# EAGLE design carteAlim (EAGLE 6.4)
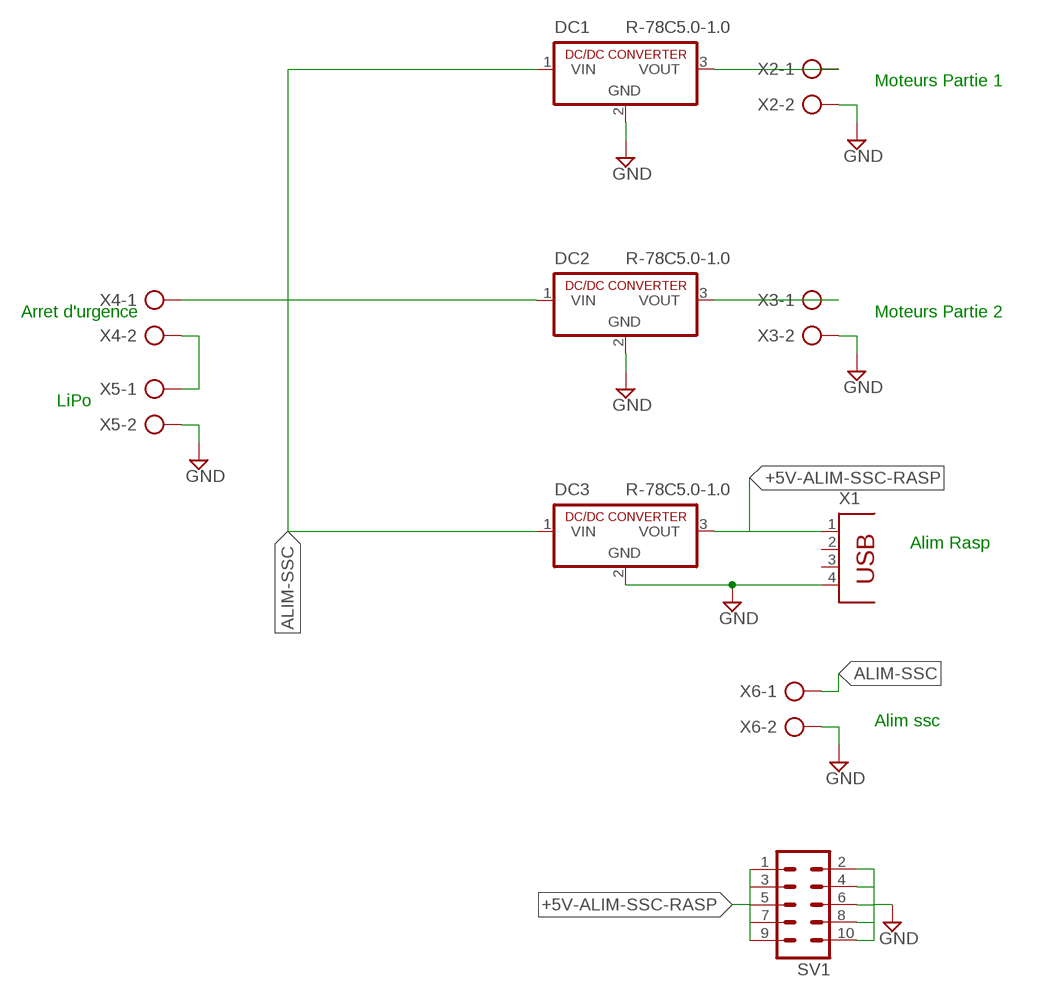
[diagram p0: schematic, sheet 1]

## Parts
DC1  R-78C5.0-1.0  [SIP3]
DC2  R-78C5.0-1.0  [SIP3]
DC3  R-78C5.0-1.0  [SIP3]
SV1  MA05-2  [MA05-2]
X1  PN87520  [PN87520]
X2  AK300/2  [AK300/2]
X3  AK300/2  [AK300/2]
X4  AK300/2  [AK300/2]
X5  AK300/2  [AK300/2]
X6  AK300/2  [AK300/2]

## Nets
+5V-ALIM-SSC-RASP: DC3.3(VOUT) SV1.1 SV1.9 X1.1
ALIM-SSC: DC1.1(VIN) DC2.1(VIN) DC3.1(VIN) X4.1 X6.1
GND: DC1.2(GND) DC2.2(GND) DC3.2(GND) SV1.2 SV1.4 SV1.6 SV1.8 SV1.10 X1.4 X2.2 X3.2 X5.2 X6.2
N$2: X4.2 X5.1
N$5: DC1.3(VOUT) X2.1
N$6: DC2.3(VOUT) X3.1
Unconnected: SV1.3 SV1.5 SV1.7 X1.2 X1.3

## Notes on the sheet
- Moteurs Partie 1
- Arret d'urgence | Moteurs Partie 2
- LiPo
- Alim Rasp
- Alim ssc

## Library data of the parts
DC1-DC3 = dc-dc-converter:R-78C*-1.0: INNOLINE DC/DC-Converter 1.0 AMP SIP3 Single Output Source: Data sheet <http://www.mikrocontroller.net/attachment/150645/157764-da-01-en-DC_DC_WANDLER_R_78C5_0_1_0.pdf>
SV1 = con-lstb:MA05-2: PIN HEADER; OC_FARNELL: unknown; OC_NEWARK: unknown
X1 = con-berg:PN87520: BERG USB connector; OC_FARNELL: unknown; OC_NEWARK: unknown
X2-X6 = con-ptr500:AK300/2: CONNECTOR; OC_FARNELL: unknown; OC_NEWARK: unknown

## Board
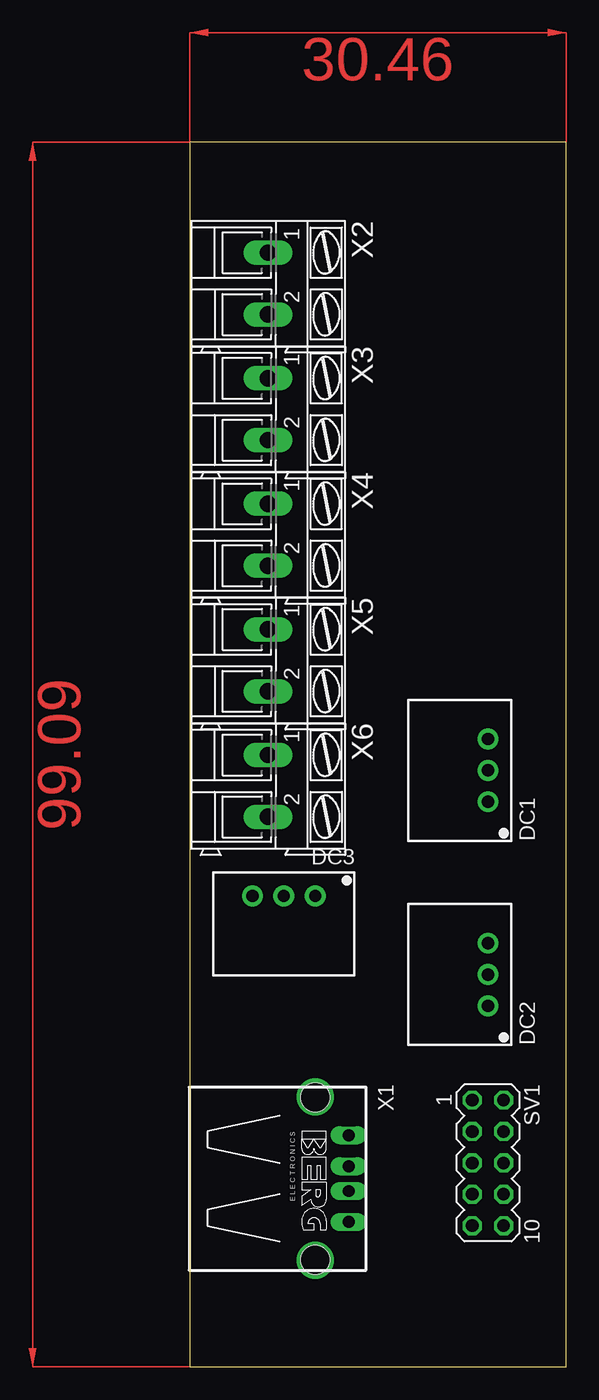
[diagram p1: board, top side]
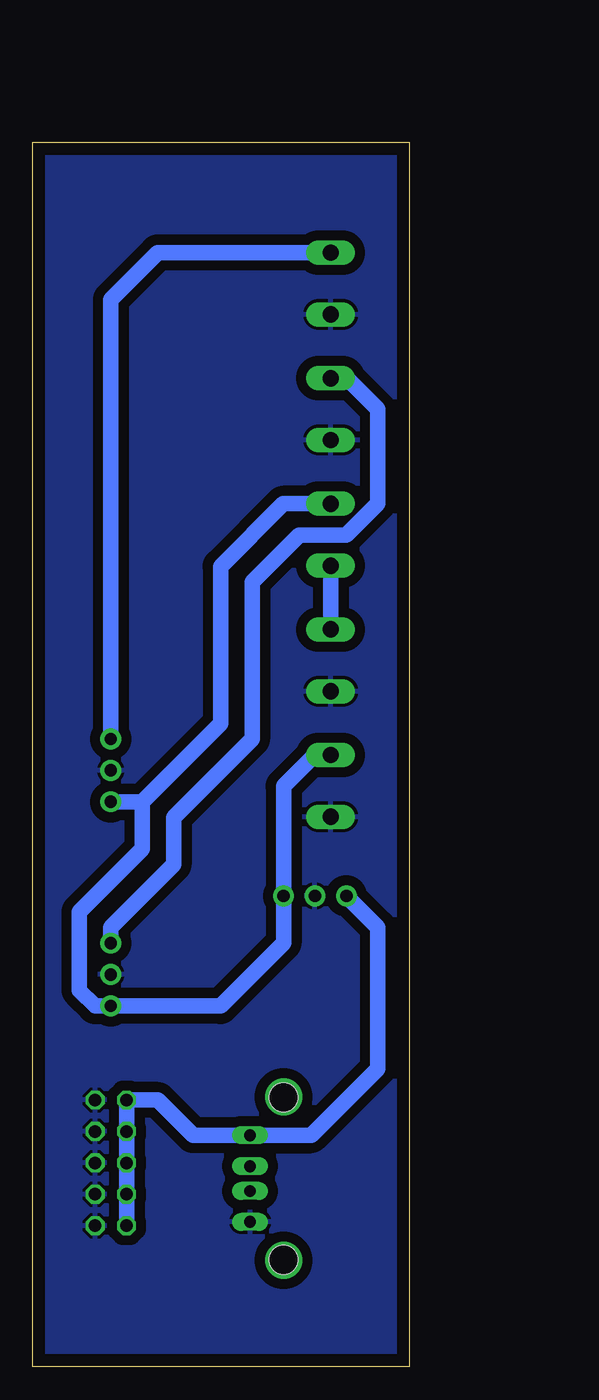
[diagram p2: board, bottom side, seen from below]

Size 30.46 x 99.09 mm. Coordinates in mm from the lower left corner, seen from the top.
Outline: 0,0 30.46,0 30.46,99.09 0,99.09 0,0
Copper layers (1*16): Top 0.035mm / dielectric 1.5mm / Bottom 0.035mm
Design rules "default *": minimum track width 10mil, minimum drill 24mil, track to track 12mil, track to pad 12mil, pad to pad 12mil, via to via 12mil, smd to smd 12mil, copper to edge 40mil, drill to drill 8mil, minimum pad ring 10mil, minimum via ring 8mil, stop-mask expansion 4mil, vias tented up to drill 0mil, thermal gap 10mil

### Footprints (pad centres in the part's own frame; a part is rotated, then mirrored left to right if it is on the bottom)
SIP3 = drill 1 pad 1.676: 1 -2.54,0; 2 0,0; 3 2.54,0
MA05-2 = drill 1.016 octagon: 1 -5.08,-1.27; 2 -5.08,1.27; 3 -2.54,-1.27; 4 -2.54,1.27; 5 0,-1.27; 6 0,1.27; 7 2.54,-1.27; 8 2.54,1.27; 9 5.08,-1.27; 10 5.08,1.27
PN87520 = drill 0.95 long: 1 -3.5,2.71; 2 -1,2.71; 3 1,2.71; 4 3.5,2.71 | hole 2.3: -6.57,0; 6.57,0
AK300/2 = drill 1.321 long: 1 -2.515,0; 2 2.489,0

### Placement (x,y rotation side)
DC1  24.13,48.26 90 top
DC2  24.13,31.75 90 top
DC3  7.62,38.1 180 top
SV1  24.13,16.51 270 top
X1  10.16,15.24 270 top
X2  6.35,87.63 270 top
X3  6.35,77.47 270 top
X4  6.35,67.31 270 top
X5  6.35,57.15 270 top
X6  6.35,46.99 270 top

### Tracks (layer width: path | path; a pad name or v marks a point on that pad's centre or on a via)
+5V-ALIM-SSC-RASP
  Bottom 1.27: SV1.9 SV1.1 20.32,21.59 17.47,18.74 X1.1 7.93,18.74 2.54,24.13 2.54,35.56 DC3.3
ALIM-SSC
  Bottom 1.27: X4.1 10.19,69.83 15.24,64.77 15.24,52.07 21.59,45.72 | 21.59,45.72 DC1.1 | 21.59,45.72 21.59,41.91 26.67,36.83 26.67,30.48 25.4,29.21 DC2.1 15.24,29.21 10.16,34.29 DC3.1 10.16,46.99 7.64,49.51 X6.1
GND
  pour Bottom (isolate 0.813): -1.27,99.06 31.75,99.06 31.75,-1.27 -1.27,-1.27
N$2
  Bottom 1.27: X4.2 X5.1
N$5
  Bottom 1.27: X2.1 20.34,90.14 24.13,86.36 DC1.3
N$6
  Bottom 1.27: X3.1 5.05,79.98 2.54,77.47 2.54,69.85 5.08,67.31 8.89,67.31 12.7,63.5 12.7,50.8 19.05,44.45 19.05,40.64 24.13,35.56 DC2.3
N$9  (via drill 2)
  other vias: 10.16,21.84
N$10  (via drill 2)
  other vias: 10.16,8.64
(copper drawn outside any net)
  shapes: Top area x2